# EAGLE schematic working (EAGLE 8.7.0)
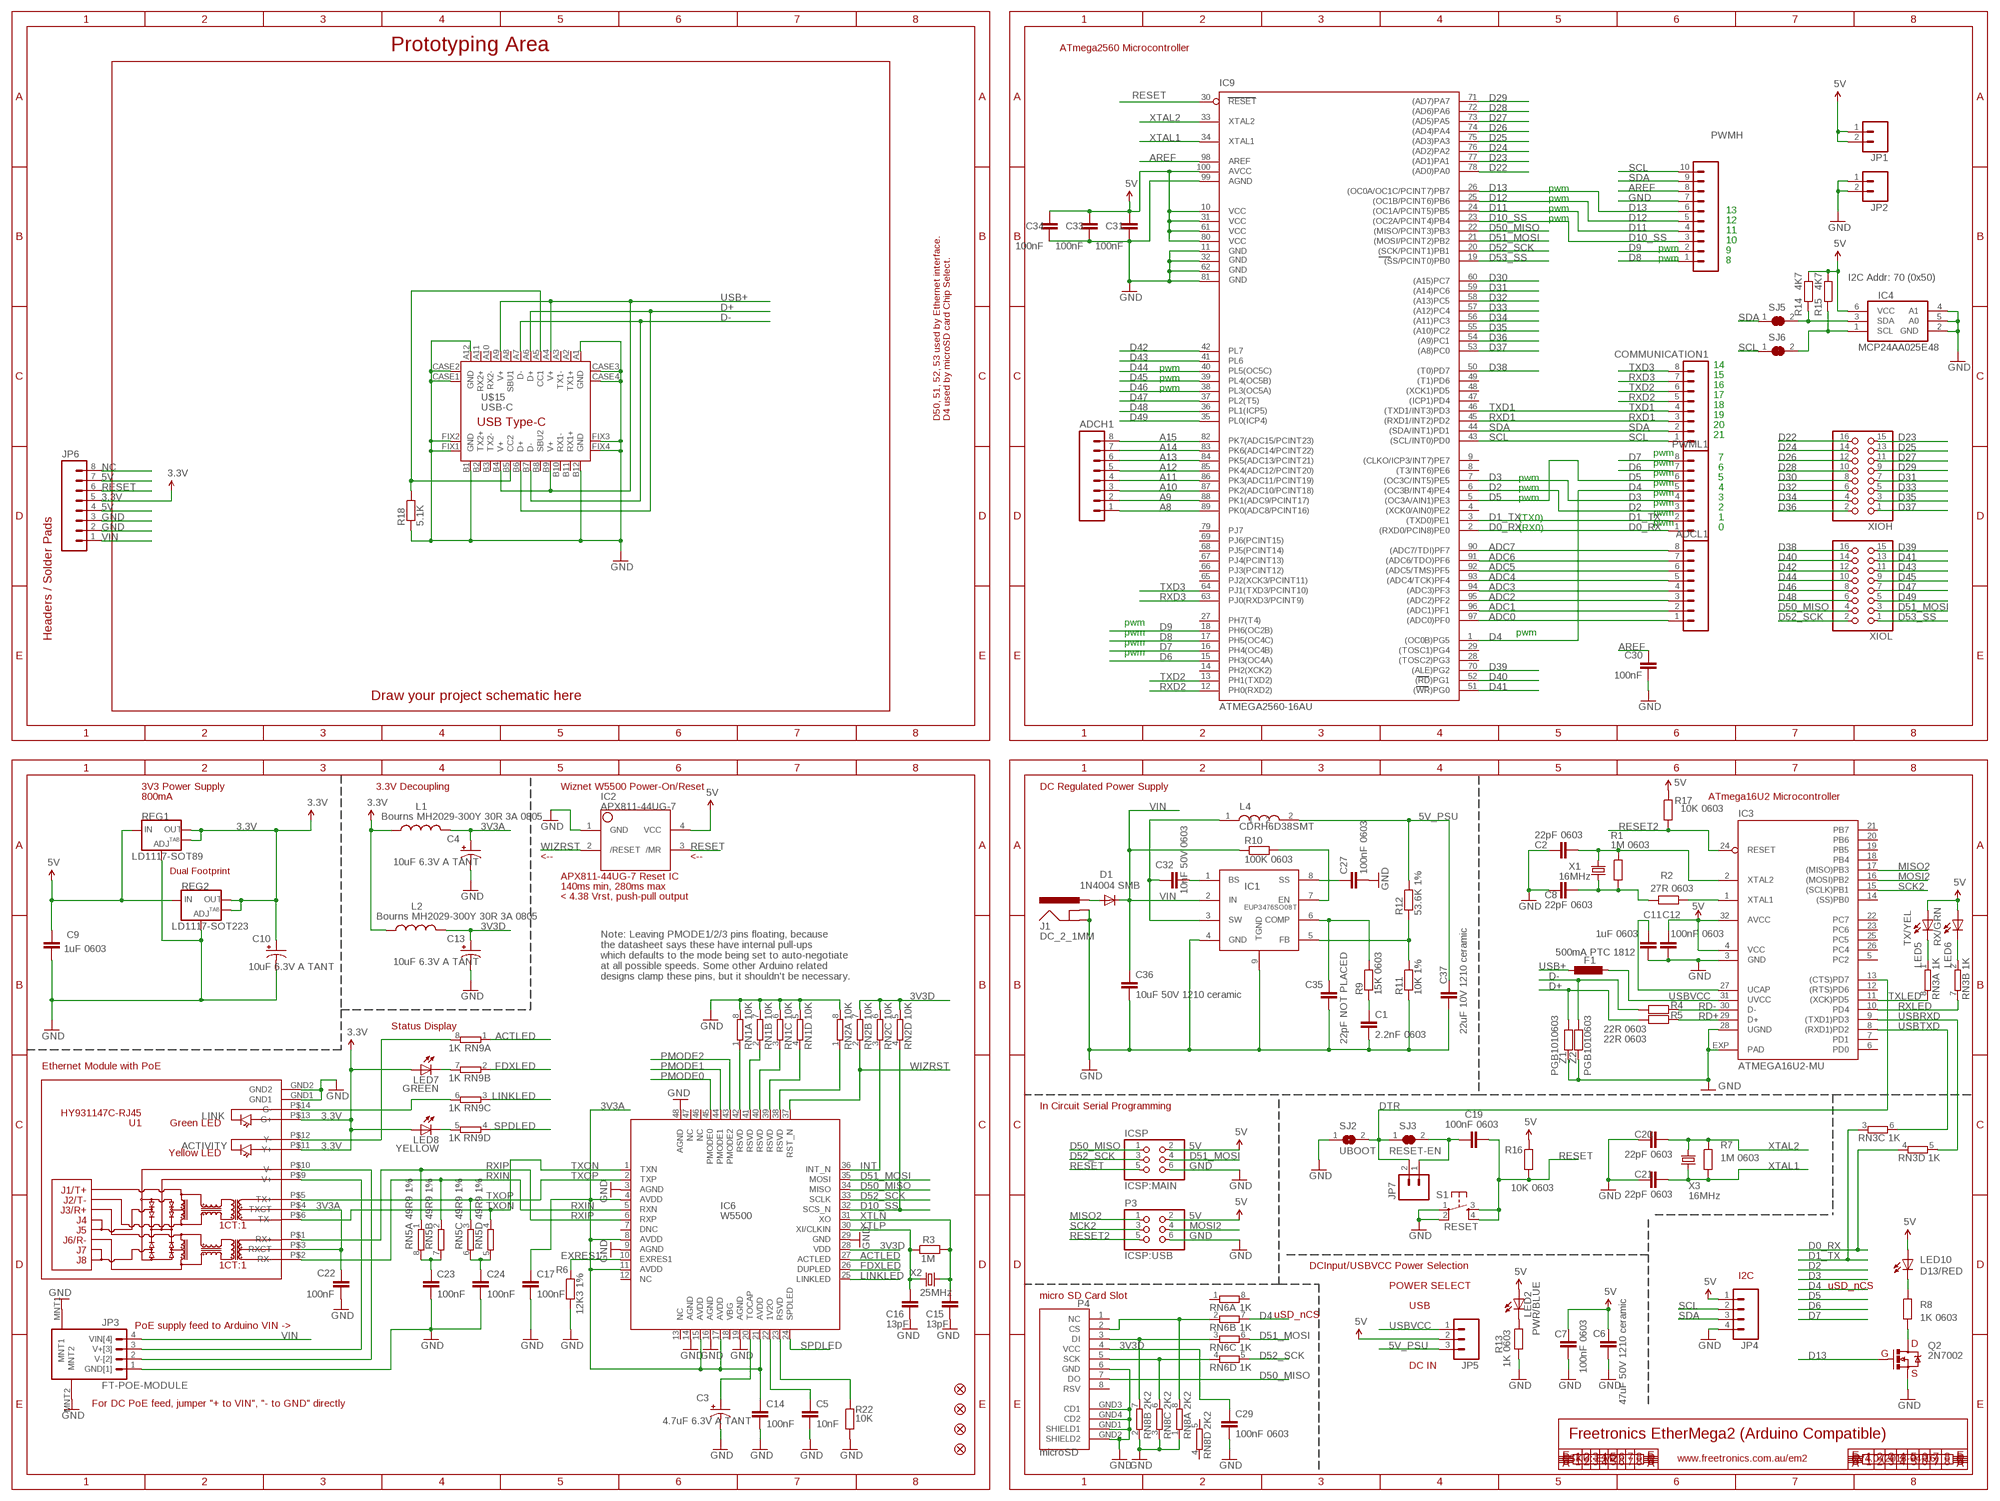
[diagram p0: schematic, sheet 1]

## Parts
ADCH1  M08STD  [1X08]
ADCL1  M08STD  [1X08]
C1  2.2nF 0603  CAP0603  [0603]
C2  22pF 0603  CAP0603  [0603]
C3  4.7uF 6.3V A TANT  CAP_POL1206  [EIA3216]
C4  10uF 6.3V A TANT  CAP_POL1206  [EIA3216]
C5  10nF  CAP0603  [0603]
C6  47uF 50V 1210 ceramic  C-EUC1210  [C1210]
C7  100nF 0603  CAP0603  [0603]
C8  22pF 0603  CAP0603  [0603]
C9  1uF 0603  CAP0603  [0603]
C10  10uF 6.3V A TANT  CAP_POL1206  [EIA3216]
C11  1uF 0603  CAP0603  [0603]
C12  100nF 0603  CAP0603  [0603]
C13  10uF 6.3V A TANT  CAP_POL1206  [EIA3216]
C14  100nF  CAP0603  [0603]
C15  13pF  CAP0603  [0603]
C16  13pF  CAP0603  [0603]
C17  100nF  CAP0603  [0603]
C19  100nF 0603  CAP0603  [0603]
C20  22pF 0603  CAP0603  [0603]
C21  22pF 0603  CAP0603  [0603]
C22  100nF  CAP0603  [0603]
C23  100nF  CAP0603  [0603]
C24  100nF  CAP0603  [0603]
C27  100nF 0603  CAP0603  [0603]
C29  100nF 0603  CAP0603  [0603]
C30  100nF  CAP0603  [0603]
C31  100nF  CAP0603  [0603]
C32  10nF 50V 0603  CAP0603  [0603]
C33  100nF  CAP0603  [0603]
C34  100nF  CAP0603  [0603]
C35  22pF NOT PLACED  CAP0603  [0603]
C36  10uF 50V 1210 ceramic  C-EUC1210  [C1210]
C37  22uF 10V 1210 ceramic  C-EUC1210  [C1210]
COMMUNICATION1  M08STD  [1X08]
D1  1N4004 SMB  DIODESMB  [SMB-DIODE]
F1  500mA PTC 1812  L-EUL1812  [L1812]
FID1  FIDUCIAL1X2.5  [FIDUCIAL-1X2.5]
FID2  FIDUCIAL1X2.5  [FIDUCIAL-1X2.5]
FID3  FIDUCIAL1X2.5  [FIDUCIAL-1X2.5]
FID4  FIDUCIAL1X2.5  [FIDUCIAL-1X2.5]
IC1  EUP3476SO08T  [SO08T]
IC2  APX811-44UG-7  APX81X-RESET-IC  [SOT143-R]
IC3  ATMEGA16U2-MU  ATMEL_ATMEGA8U2-MUQFN  [ATMEL_QFN32]
IC4  MCP24AA025E48  [SOT23-6]
IC6  W5500  [W5500]
IC9  ATMEGA2560-16AU  ATMEGA1280-16AU  [TQFP100]
ICSP  ICSP:MAIN  PINHD-2X3  [2X03]
J1  DC_2_1MM  POWER_JACKPTH_SLOTS  [POWER_JACK_PTH_SLOTS]
JP1  M02PTH  [1X02]
JP2  M02PTH  [1X02]
JP3  FT-POE-MODULE  FT-POE-MODULE2  [FT-POE-MODULE-CLEAN]
JP4  M04PTH  [1X04]
JP5  M03PTH  [1X03]
JP6  M08STD  [1X08]
JP7  M02PTH  [1X02]
L1  Bourns MH2029-300Y 30R 3A 0805  L-USL2012C  [L2012C]
L2  Bourns MH2029-300Y 30R 3A 0805  L-USL2012C  [L2012C]
L4  CDRH6D38SMT  [CDRH]
LED2  PWR/BLUE  LED0603  [LED-0603]
LED5  TX/YEL  LED0603  [LED-0603]
LED6  RX/GRN  LED0603  [LED-0603]
LED7  GREEN  LED0603  [LED-0603]
LED8  YELLOW  LED0603  [LED-0603]
LED10  D13/RED  LED0603  [LED-0603]
P3  ICSP:USB  PINHD-2X3  [2X03]
P4  microSD  USD-SOCKETHINGE  [MOLEX-SD-500901-003]
PWMH  M100.1  [1X10]
PWML1  M08STD  [1X08]
Q2  2N7002  MOSFET-NCHANNELSMD  [SOT23-3]
R1  1M 0603  RESISTOR0603  [0603]
R2  27R 0603  RESISTOR0603  [0603]
R3  1M  RESISTOR0603  [0603]
R4  22R 0603  RESISTOR0603  [0603]
R5  22R 0603  RESISTOR0603  [0603]
R6  12K3 1%  RESISTOR0603  [0603]
R7  1M 0603  RESISTOR0603  [0603]
R8  1K 0603  RESISTOR0603  [0603]
R9  15K 0603  RESISTOR0603  [0603]
R10  100K 0603  RESISTOR0603  [0603]
R11  10K 1%  RESISTOR0603  [0603]
R12  53.6K 1%  RESISTOR0603  [0603]
R13  1K 0603  RESISTOR0603  [0603]
R14  4K7  RESISTOR0603  [0603]
R15  4K7  RESISTOR0603  [0603]
R16  10K 0603  RESISTOR0603  [0603]
R17  10K 0603  RESISTOR0603  [0603]
R18  5.1K  RESISTOR0603  [0603]
R22  10K  RESISTOR0603  [0603]
REG1  LD1117-SOT89  V_REG_LM1117SOT89  [SOT89]
REG2  LD1117-SOT223  V_REG_LM1117SOT223  [SOT223]
RN1  10K  4R-NCAY16  [CAY16]
RN2  10K  4R-NCAY16  [CAY16]
RN3  1K  4R-NCAY16  [CAY16]
RN5  49R9 1%  4R-NCAY16  [CAY16]
RN6  1K  4R-NCAY16  [CAY16]
RN8  2K2  4R-NCAY16  [CAY16]
RN9  1K  4R-NCAY16  [CAY16]
S1  RESET  TAC_SWITCHSMD  [TACTILE_SWITCH_SMD]
SJ2  UBOOT  SJ  [SJ]
SJ3  RESET-EN  SJCN  [SJC]
SJ5  SJCN  [SJC]
SJ6  SJCN  [SJC]
U1  HY931147C-RJ45  [HY931147C]
U$15  USB-C  [USB-C-U52A]
X1  16MHz  CRYSTALHC49UV  [HC49U-V]
X2  25MHz  CRYSTALHC49UV  [HC49U-V]
X3  16MHz  CRYSTALHC49UV  [HC49U-V]
XIOH  PINHD-2X8  [2X08]
XIOL  PINHD-2X8  [2X08]
Z1  PGB1010603  RESISTOR0603  [0603]
Z2  PGB1010603  RESISTOR0603  [0603]

## Nets
3.3V: C10.A(+) JP6.5 L1.1 L2.1 LED7.A LED8.A REG1.2(OUT) REG1.4(OUT) REG2.2(OUT) REG2.4(OUT) U1.P$11(Y+) U1.P$13(G+)
3V3A: C4.A(+) C14.1 C17.1 C22.1 IC6.4(AVDD) IC6.8(AVDD) IC6.11(AVDD) IC6.15(AVDD) IC6.17(AVDD) IC6.21(AVDD) L1.2 U1.P$3(RXCT) U1.P$4(TXCT)
3V3D: C13.A(+) C29.1 IC6.28(VDD) L2.2 P4.4(VCC) RN2.5 RN2.6 RN2.7
5V [power]: C6.2 C7.1 C9.1 C12.1 C31.1 C33.1 C34.1 IC2.4(VCC) IC3.4(VCC) IC3.32(AVCC) IC4.6(VCC) IC9.10(VCC) IC9.31(VCC1) IC9.61(VCC2) IC9.80(VCC3) IC9.100(AVCC) ICSP.2 JP1.1 JP1.2 JP4.1 JP5.2 JP6.4 JP6.7 LED2.A LED5.A LED6.A LED10.A P3.2 R14.1 R15.1 R16.2 R17.2 REG1.3(IN) REG2.3(IN)
5V_PSU [power]: C37.1 JP5.3 L4.2 R12.2
A8: ADCH1.1 IC9.89(PK0(ADC8/PCINT16))
A9: ADCH1.2 IC9.88(PK1(ADC9/PCINT17))
A10: ADCH1.3 IC9.87(PK2(ADC10/PCINT18))
A11: ADCH1.4 IC9.86(PK3(ADC11/PCINT19))
A12: ADCH1.5 IC9.85(PK4(ADC12/PCINT20))
A13: ADCH1.6 IC9.84(PK5(ADC13/PCINT21))
A14: ADCH1.7 IC9.83(PK6(ADC14/PCINT22))
A15: ADCH1.8 IC9.82(PK7(ADC15/PCINT23))
ACTLED: IC6.27(ACTLED) RN9.1
ADC0: ADCL1.1 IC9.97((ADC0)PF0)
ADC1: ADCL1.2 IC9.96((ADC1)PF1)
ADC2: ADCL1.3 IC9.95((ADC2)PF2)
ADC3: ADCL1.4 IC9.94((ADC3)PF3)
ADC4: ADCL1.5 IC9.93((ADC4/TCK)PF4)
ADC5: ADCL1.6 IC9.92((ADC5/TMS)PF5)
ADC6: ADCL1.7 IC9.91((ADC6/TDO)PF6)
ADC7: ADCL1.8 IC9.90((ADC7/TDI)PF7)
AREF: C30.1 IC9.98(AREF) PWMH.8
D0_RX: IC9.2((RXD0/PCIN8)PE0) PWML1.1 RN3.4
D1_TX: IC9.3((TXD0)PE1) PWML1.2 RN3.3
D2: IC9.6((OC3B/INT4)PE4) PWML1.3
D3: IC9.7((OC3C/INT5)PE5) PWML1.4
D4: IC9.1((OC0B)PG5) PWML1.5 RN6.7
D5: IC9.5((OC3A/AIN1)PE3) PWML1.6
D6: IC9.15(PH3(OC4A)) PWML1.7
D7: IC9.16(PH4(OC4B)) PWML1.8
D8: IC9.17(PH5(OC4C)) PWMH.1
D9: IC9.18(PH6(OC2B)) PWMH.2
D10_SS: IC6.32(SCS_N) IC9.23((OC2A/PCINT4)PB4) PWMH.3 RN2.4
D11: IC9.24((OC1A/PCINT5)PB5) PWMH.4
D12: IC9.25((OC1B/PCINT6)PB6) PWMH.5
D13: IC9.26((OC0A/OC1C/PCINT7)PB7) PWMH.6 Q2.1(G)
D22: IC9.78((AD0)PA0) XIOH.16
D23: IC9.77((AD1)PA1) XIOH.15
D24: IC9.76((AD2)PA2) XIOH.14
D25: IC9.75((AD3)PA3) XIOH.13
D26: IC9.74((AD4)PA4) XIOH.12
D27: IC9.73((AD5)PA5) XIOH.11
D28: IC9.72((AD6)PA6) XIOH.10
D29: IC9.71((AD7)PA7) XIOH.9
D30: IC9.60((A15)PC7) XIOH.8
D31: IC9.59((A14)PC6) XIOH.7
D32: IC9.58((A13)PC5) XIOH.6
D33: IC9.57((A12)PC4) XIOH.5
D34: IC9.56((A11)PC3) XIOH.4
D35: IC9.55((A10)PC2) XIOH.3
D36: IC9.54((A9)PC1) XIOH.2
D37: IC9.53((A8)PC0) XIOH.1
D38: IC9.50((T0)PD7) XIOL.16
D39: IC9.70((ALE)PG2) XIOL.15
D40: IC9.52((RD)PG1) XIOL.14
D41: IC9.51((WR)PG0) XIOL.13
D42: IC9.42(PL7) XIOL.12
D43: IC9.41(PL6) XIOL.11
D44: IC9.40(PL5(OC5C)) XIOL.10
D45: IC9.39(PL4(OC5B)) XIOL.9
D46: IC9.38(PL3(OC5A)) XIOL.8
D47: IC9.37(PL2(T5)) XIOL.7
D48: IC9.36(PL1(ICP5)) XIOL.6
D49: IC9.35(PL0(ICP4)) XIOL.5
D50_MISO: IC6.34(MISO) IC9.22((MISO/PCINT3)PB3) ICSP.1 P4.7(DO) XIOL.4
D51_MOSI: IC6.35(MOSI) IC9.21((MOSI/PCINT2)PB2) ICSP.4 RN6.6 XIOL.3
D52_SCK: IC6.33(SCLK) IC9.20((SCK/PCINT1)PB1) ICSP.3 RN6.5 XIOL.2
D53_SS: IC9.19((SS/PCINT0)PB0) XIOL.1
D+: R5.2 U$15.A6(D+) U$15.B6(D+) Z1.1
D-: R4.2 U$15.A7(D-) U$15.B7(D-) Z2.1
DTR: IC3.13((CTS)PD7) JP7.2 SJ2.2 SJ3.1
EXRES1: IC6.10(EXRES1) R6.2
FDXLED: IC6.26(DUPLED) RN9.2
GND: C1.2 C2.1 C3.C(-) C4.C(-) C5.2 C6.1 C7.2 C8.1 C9.2 C10.C(-) C11.2 C12.2 C13.C(-) C14.2 C15.2 C16.2 C17.2 C20.1 C21.1 C22.2 C23.2 C24.2 C27.2 C29.2 C30.2 C31.2 C33.2 C34.2 C35.2 C36.2 C37.2 IC1.4(GND) IC1.9(TGND) IC2.1(GND) IC3.3(GND) IC3.28(UGND) IC3.EXP(PAD) IC4.2(GND) IC4.4(A1) IC4.5(A0) IC6.3(AGND) IC6.9(AGND) IC6.14(AGND) IC6.16(AGND) IC6.19(AGND) IC6.29(GND) IC6.48(AGND) IC9.11(GND) IC9.32(GND1) IC9.62(GND2) IC9.81(GND3) IC9.99(AGND) ICSP.6 J1.GND J1.GNDBREAK JP2.1 JP2.2 JP3.1(GND[1]) JP3.MNT1 JP3.MNT2 JP4.4 JP6.2 JP6.3 P3.6 P4.6(GND) P4.GND1(SHIELD1) P4.GND2(SHIELD2) P4.GND3(CD1) P4.GND4(CD2) PWMH.7 Q2.2(S) R6.1 R11.1 R13.1 R18.1 R22.1 REG1.1(ADJ) REG2.1(ADJ) RN1.5 RN1.6 RN1.7 RN1.8 RN2.8 RN8.1 RN8.2 RN8.3 S1.1 S1.2 SJ2.1 U1.GND1 U1.GND2 U$15.A1(GND) U$15.A12(GND) U$15.B1(GND) U$15.B12(GND) U$15.CASE1(GND) U$15.CASE2(GND) U$15.CASE3(GND) U$15.CASE4(GND) U$15.FIX1(GND) U$15.FIX2(GND) U$15.FIX3(GND) U$15.FIX4(GND) Z1.2 Z2.2
INT: IC6.36(INT_N) RN2.3
LINKLED: IC6.25(LINKLED) RN9.3
MISO2: IC3.17((MISO)PB3) P3.1
MOSI2: IC3.16((MOSI)PB2) P3.4
N$1: C24.1 RN5.5 RN5.6
N$4: LED10.C R8.2
N$6: Q2.3(D) R8.1
N$8: IC3.1(XTAL1) R2.1
N$9: IC4.1(SCL) R15.2 SJ6.2
N$11: LED6.C RN3.2
N$12: LED2.C R13.2
N$13: LED5.C RN3.1
N$19: IC4.3(SDA) R14.2 SJ5.2
N$20: P4.5(SCK) RN6.4 RN8.6
N$24: P4.2(CS) RN6.2 RN8.8
N$25: P4.3(DI) RN6.3 RN8.7
N$26: LED8.C RN9.5
N$28: RN9.6 U1.P$14(G-)
N$60: D1.A J1.PWR
N$62: IC6.39(RSVD) RN1.4
N$63: IC6.40(RSVD) RN1.3
N$64: C27.1 IC1.8(SS)
N$65: C1.1 R9.1
N$66: C35.1 IC1.6(COMP) R9.2
N$67: R18.2 U$15.A5(CC1) U$15.B5(CC2)
N$68: JP3.3(V+[3]) U1.P$9(V+)
N$69: JP3.2(V-[2]) U1.P$10(V-)
N$70: C32.1 IC1.3(SW) L4.1
N$71: C32.2 IC1.1(BS)
N$72: IC1.7(EN) R10.2
N$73: IC6.41(RSVD) RN1.2
N$75: C19.1 JP7.1 SJ3.2
N$76: IC6.42(RSVD) RN1.1
N$77: IC1.5(FB) R11.2 R12.1
N$78: IC6.23(RSVD) R22.2
N$79: IC6.38(RSVD) RN2.1
N$80: C5.1 IC6.22(1V2O)
N$81: C3.A(+) IC6.20(TOCAP)
N$113: C2.2 IC3.2(XTAL2) R1.2 X1.2
N$114: C8.2 R1.1 R2.2 X1.1
N$117: C11.1 IC3.27(UCAP)
N$321: C23.1 RN5.7 RN5.8
N$327: LED7.C RN9.7
N$329: RN9.8 U1.P$12(Y-)
NC: JP6.8
PMODE0: IC6.45(PMODE0)
PMODE1: IC6.44(PMODE1)
PMODE2: IC6.43(PMODE2)
RD+: IC3.29(D+) R5.1
RD-: IC3.30(D-) R4.1
RESET: C19.2 IC2.3(/MR) IC9.30(RESET) ICSP.5 JP6.6 R16.1 S1.3 S1.4
RESET2: IC3.24(RESET) P3.5 R17.1
RXD1: COMMUNICATION1.3 IC9.45((RXD1/INT2)PD2)
RXD2: COMMUNICATION1.5 IC9.12(PH0(RXD2))
RXD3: COMMUNICATION1.7 IC9.63(PJ0(RXD3/PCINT9))
RXIN: IC6.5(RXN) RN5.2 U1.P$2(RX-)
RXIP: IC6.6(RXP) RN5.1 U1.P$1(RX+)
RXLED: IC3.10(PD4) RN3.7
SCK2: IC3.15((SCLK)PB1) P3.3
SCL: COMMUNICATION1.1 IC9.43((SCL/INT0)PD0) JP4.2 PWMH.10 SJ6.1
SDA: COMMUNICATION1.2 IC9.44((SDA/INT1)PD1) JP4.3 PWMH.9 SJ5.1
SPDLED: IC6.24(SPDLED) RN9.4
TXD1: COMMUNICATION1.4 IC9.46((TXD1/INT3)PD3)
TXD2: COMMUNICATION1.6 IC9.13(PH1(TXD2))
TXD3: COMMUNICATION1.8 IC9.64(PJ1(TXD3/PCINT10))
TXLED: IC3.11((XCK)PD5) RN3.8
TXON: IC6.1(TXN) RN5.4 U1.P$6(TX-)
TXOP: IC6.2(TXP) RN5.3 U1.P$5(TX+)
USB+: F1.1 U$15.A4(V+) U$15.A9(V+) U$15.B4(V+) U$15.B9(V+)
USBRXD: IC3.9((TXD1)PD3) RN3.5
USBTXD: IC3.8((RXD1)PD2) RN3.6
USBVCC: F1.2 IC3.31(UVCC) JP5.1
VIN: C36.1 D1.C IC1.2(IN) JP3.4(VIN[4]) JP6.1 R10.1
WIZRST: IC2.2(/RESET) IC6.37(RST_N) RN2.2
XTAL1: C21.2 IC9.34(XTAL1) R7.1 X3.1
XTAL2: C20.2 IC9.33(XTAL2) R7.2 X3.2
XTLN: C15.1 IC6.31(XO) R3.1 X2.1
XTLP: C16.1 IC6.30(XI/CLKIN) R3.2 X2.2
Unconnected: IC3.5(PC2) IC3.6(PD0) IC3.7(PD1) IC3.12((RTS)PD6) IC3.14((SS)PB0) IC3.18(PB4) IC3.19(PB5) IC3.20(PB6) IC3.21(PB7) IC3.22(PC7) IC3.23(PC6) IC3.25(PC5) IC3.26(PC4) IC6.7(DNC) IC6.12(NC) IC6.13(NC) IC6.18(VBG) IC6.46(NC) IC6.47(NC) IC9.4((XCK0/AIN0)PE2) IC9.8((T3/INT6)PE6) IC9.9((CLKO/ICP3/INT7)PE7) IC9.14(PH2(XCK2)) IC9.27(PH7(T4)) IC9.28((TOSC2)PG3) IC9.29((TOSC1)PG4) IC9.47((ICP1)PD4) IC9.48((XCK1)PD5) IC9.49((T1)PD6) IC9.65(PJ2(XCK3/PCINT11)) IC9.66(PJ3(PCINT12)) IC9.67(PJ4(PCINT13)) IC9.68(PJ5(PCINT14)) IC9.69(PJ6(PCINT15)) IC9.79(PJ7) P4.1(NC) P4.8(RSV) RN6.1 RN6.8 RN8.4 RN8.5 U$15.A2(TX1+) U$15.A3(TX1-) U$15.A8(SBU1) U$15.A10(RX2-) U$15.A11(RX2+) U$15.B2(TX2+) U$15.B3(TX2-) U$15.B8(SBU2) U$15.B10(RX1-) U$15.B11(RX1+)

## Notes on the sheet
- Prototyping Area | ATmega2560 Microcontroller
- pwm
- pwm
- pwm | 13
- pwm | 12
- 11
- 10
- pwm | 9
- pwm | 8
- I2C Addr: 70 (0x50)
- pwm | 14
- pwm | 15
- pwm | 16
- 17
- 18
- D50, 51, 52, 53 used by Ethernet interface. | D4 used by microSD card Chip Select. | 19
- 20
- 21
- pwm
- 7
- pwm
- 6
- pwm
- pwm | 5
- pwm
- pwm | 4
- pwm
- pwm | 3
- pwm
- 2
- pwm
- (TX0) | 1
- pwm
- (RX0) | 0
- pwm
- pwm | pwm
- Headers / Solder Pads
- pwm
- pwm
- Draw your project schematic here
- 3V3 Power Supply | 3.3V Decoupling | Wiznet W5500 Power-On/Reset | DC Regulated Power Supply
- 800mA | ATmega16U2 Microcontroller
- <-- | <--
- Dual Footprint
- APX811-44UG-7 Reset IC
- 140ms min, 280ms max
- < 4.38 Vrst, push-pull output
- Note: Leaving PMODE1/2/3 pins floating, because
  the datasheet says these have internal pull-ups
  which defaults to the mode being set to auto-negotiate
  at all possible speeds. Some other Arduino related
  designs clamp these pins, but it shouldn't be necessary.
- Status Display
- Ethernet Module with PoE
- In Circuit Serial Programming
- LINK
- ACTIVITY
- DCInput/USBVCC Power Selection
- I2C
- POWER SELECT | uSD_nCS
- micro SD Card Slot
- USB
- uSD_nCS
- PoE supply feed to Arduino VIN ->
- D
- G
- DC IN
- S
- For DC PoE feed, jumper "+ to VIN", "- to GND" directly
- Freetronics EtherMega2 (Arduino Compatible)
- SKU: EM2 | www.freetronics.com.au/em2 | V4.0 (2018-04-16)

## Library data of the parts
ADCH1 ADCL1 COMMUNICATION1 JP6 PWML1 = freetronics-master-v1.1:M08: Header 8 Standard 8-pin 0.1" header. Use with straight break away headers (SKU : PRT-00116), right angle break away headers (PRT-00553), swiss pins (PRT-00743), machine pins (PRT-00117), and female headers (PRT-00115).
C1 C2 C7-C9 C12 C15 C16 C19-C24 C27 C29-C35 = freetronics-marc:CAP: Capacitor Standard 0603 ceramic capacitor, and 0.1" leaded capacitor.
C3 C4 C10 C13 = freetronics:CAP_POL: Capacitor Polarized These are standard SMD and PTH capacitors. Normally 10uF, 47uF, and 100uF in electrolytic and tantalum varieties. Always verify the external diameter of the through hole cap, it varies with capacity, voltage, and manufacturer. The EIA devices should be standard.
C5 C14 C17 = freetronics-jon:CAP: Capacitor Standard 0603 ceramic capacitor, and 0.1" leaded capacitor.
C6 C36 C37 = freetronics-jon:C-EU: CAPACITOR, European symbol
C11 = freetronics-master-v1:CAP: Capacitor Standard 0603 ceramic capacitor, and 0.1" leaded capacitor.
D1 = freetronics:DIODE: Diode These are standard reverse protection diodes and small signal diodes. SMA package can handle up to about 1A. SOD-323 can handle about 200mA. What the SOD-323 package when ordering, there are some mfgs out there that are 5-pin packages.
F1 = rcl:L-EU: INDUCTOR, European symbol
FID1-FID4 = freetronics:FIDUCIAL: Fiducial Alignment Points Various fiducial points for machine vision alignment.
IC1 = freetronics-jon:EUP3476
IC2 = freetronics-master-v1:APX81X-RESET-IC
IC3 = freetronics-jon:ATMEL_ATMEGA8U2-MU
IC4 = freetronics-jon:MCP24AA025E48
IC6 = W5500:W5500
IC9 = atmel-2005:ATMEGA*: MICROCONTROLLER 64/128/256 Kbytes FLASH 4 Kbytes EEPROM 8 Kbytes SRAM 86 General Purpose I/O pins 12-channels16-bit PWM 4 x Serial USARTs 16-channels 10-bit A/D
ICSP P3 = pinhead:PINHD-2X3: PIN HEADER
J1 = freetronics-jon:POWER_JACK: Power Jack This is the standard 5.5mm barrel jack for power. The PTH is the most common, proven, reliable, footprint. All others are experimental. The Slot footprint only works if the mill layer is transmitted to the PCB fab house so be warned. Spark Fun Electronics SKU : PRT-00119. Mating wall wart : TOL-00298 (and others)
JP1 JP2 = freetronics-master-v1:M02: Header 2 Standard 2-pin 0.1" header. Use with straight break away headers (SKU : PRT-00116), right angle break away headers (PRT-00553), swiss pins (PRT-00743), machine pins (PRT-00117), and female headers (PRT-00115). Molex polarized connector foot print use with SKU : PRT-08233 with associated crimp pins and housings.
JP3 = freetronics-master-v1:FT-POE-MODULE
JP4 = freetronics-master-v1:M04: Header 4 Standard 4-pin 0.1" header. Use with straight break away headers (SKU : PRT-00116), right angle break away headers (PRT-00553), swiss pins (PRT-00743), machine pins (PRT-00117), and female headers (PRT-00115). Molex polarized connector foot print use with SKU : PRT-08231 with associated crimp pins and housings.
JP5 = freetronics-master-v1.1:M03: Header 3 Standard 3-pin 0.1" header. Use with straight break away headers (SKU : PRT-00116), right angle break away headers (PRT-00553), swiss pins (PRT-00743), machine pins (PRT-00117), and female headers (PRT-00115). Molex polarized connector foot print use with SKU : PRT-08232 with associated crimp pins and housings.
JP7 = freetronics-master-v1.1:M02: Header 2 Standard 2-pin 0.1" header. Use with straight break away headers (SKU : PRT-00116), right angle break away headers (PRT-00553), swiss pins (PRT-00743), machine pins (PRT-00117), and female headers (PRT-00115). Molex polarized connector foot print use with SKU : PRT-08233 with associated crimp pins and housings.
L1 L2 = rcl:L-US: INDUCTOR, American symbol
L4 = freetronics-jon:CDRH6D38: Inductor
LED2 LED5-LED8 LED10 = freetronics-jon:LED: LEDs Standard schematic elements and footprints for 5mm, 3mm, 1206, and 0603 sized LEDs. 5mm - Spark Fun Electronics SKU : COM-00529 (and others)
P4 = freetronics-jon:USD-SOCKET: microSD Socket Push-push type uSD socket. Schematic element and footprint production proven. Spark Fun Electronics SKU : PRT-00127. tDoc lines correctly indicate media card edge positions when inserting (unlocked, locked, depressed).
PWMH = freetronics-original:M10: Header 10 Standard 10-pin 0.1" header. Use with straight break away headers (SKU : PRT-00116), right angle break away headers (PRT-00553), swiss pins (PRT-00743), machine pins (PRT-00117), and female headers (PRT-00115).
Q2 = freetronics:MOSFET-NCHANNEL
R1-R8 R13 R16 R17 R22 = freetronics-marc:RESISTOR: Resistor Basic schematic elements and footprints for 0603, 1206, and PTH 1/10th watt (small) resistors.
R9-R12 R18 = freetronics-original:RESISTOR: Resistor Basic schematic elements and footprints for 0603, 1206, and PTH 1/10th watt (small) resistors.
R14 R15 = freetronics-master-v1.1:RESISTOR: Resistor Basic schematic elements and footprints for 0603, 1206, and PTH 1/10th watt (small) resistors.
REG1 REG2 = freetronics:V_REG_LM1117: Voltage Regulator LD1117 Adjustable low-dropout voltage regulator available in SOT89 and SOT223 SMT packages.
RN1 RN2 RN9 = freetronics-master-v1.1:4R-N: Array Chip Resistor Source: RS Component / Phycomp
RN3 RN5 RN6 RN8 = freetronics-master-v1:4R-N: Array Chip Resistor Source: RS Component / Phycomp
S1 = freetronics:TAC_SWITCH: Momentary Switch Button commonly used for reset or general input. Spark Fun Electronics SKU : COM-00097
SJ2 = jumper:SJ: SMD solder JUMPER
SJ3 SJ5 SJ6 = freetronics-jon:SJC
U1 = freetronics-jon:HY931147C
U$15 = freetronics-jon:USB-C
X1-X3 = freetronics-master-v1:CRYSTAL: Crystals Various standard crystals. Proven footprints. Spark Fun Electronics SKU : COM-00534
XIOH XIOL = pinhead:PINHD-2X8: PIN HEADER
Z1 Z2 = freetronics:RESISTOR: Resistor Basic schematic elements and footprints for 0603, 1206, and PTH 1/10th watt (small) resistors.